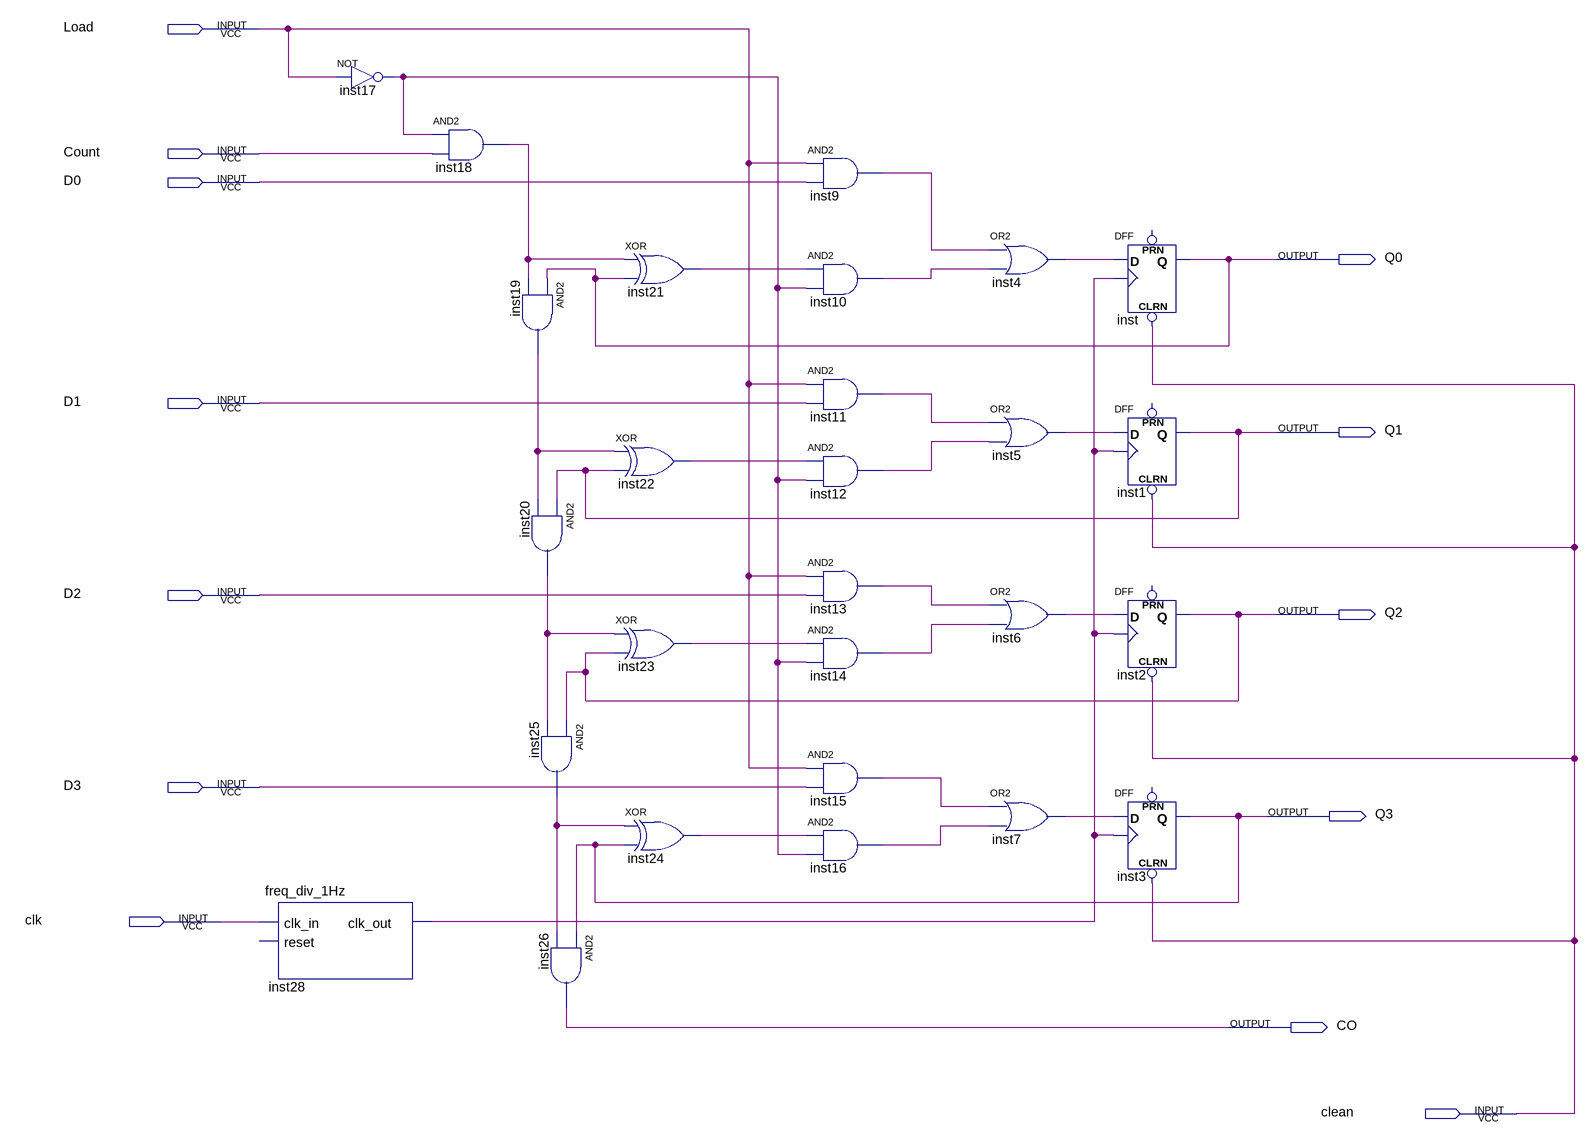
[diagram p0: schematic sheet]
// Quartus schematic counter.bdf as structural Verilog: 27 symbols, 13 pins
module counter (
  input  Load,
  input  Count,
  input  D0,
  input  D1,
  input  D2,
  input  D3,
  input  clk,
  input  clean,
  output Q0,
  output Q1,
  output Q2,
  output Q3,
  output CO
);

  wire inst4_out, inst5_out, inst6_out, inst7_out, inst9_out, inst10_out, inst11_out, inst12_out, inst13_out,
       inst14_out, inst15_out, inst16_out, inst17_out, inst18_out, inst19_out, inst20_out, inst21_out,
       inst22_out, inst23_out, inst24_out, inst25_out, inst28_clk_out;

  freq_div_1Hz inst28 (.clk_in(clk), .clk_out(inst28_clk_out));  // open: reset
  not inst17 (inst17_out, Load);
  and inst18 (inst18_out, inst17_out, Count);
  and inst19 (inst19_out, Q0, inst18_out);
  and inst20 (inst20_out, Q1, inst19_out);
  and inst25 (inst25_out, Q2, inst20_out);
  and inst26 (CO, Q3, inst25_out);
  xor inst21 (inst21_out, inst18_out, Q0);
  xor inst22 (inst22_out, inst19_out, Q1);
  xor inst23 (inst23_out, inst20_out, Q2);
  xor inst24 (inst24_out, inst25_out, Q3);
  and inst9 (inst9_out, Load, D0);
  and inst10 (inst10_out, inst21_out, inst17_out);
  and inst11 (inst11_out, Load, D1);
  and inst12 (inst12_out, inst22_out, inst17_out);
  and inst13 (inst13_out, Load, D2);
  and inst14 (inst14_out, inst23_out, inst17_out);
  and inst15 (inst15_out, Load, D3);
  and inst16 (inst16_out, inst24_out, inst17_out);
  or inst4 (inst4_out, inst9_out, inst10_out);
  or inst5 (inst5_out, inst11_out, inst12_out);
  or inst6 (inst6_out, inst13_out, inst14_out);
  or inst7 (inst7_out, inst15_out, inst16_out);
  DFF inst (.CLRN(clean), .CLK(inst28_clk_out), .D(inst4_out), .Q(Q0));  // open: PRN
  DFF inst1 (.CLRN(clean), .CLK(inst28_clk_out), .D(inst5_out), .Q(Q1));  // open: PRN
  DFF inst2 (.CLRN(clean), .CLK(inst28_clk_out), .D(inst6_out), .Q(Q2));  // open: PRN
  DFF inst3 (.CLRN(clean), .CLK(inst28_clk_out), .D(inst7_out), .Q(Q3));  // open: PRN
endmodule
